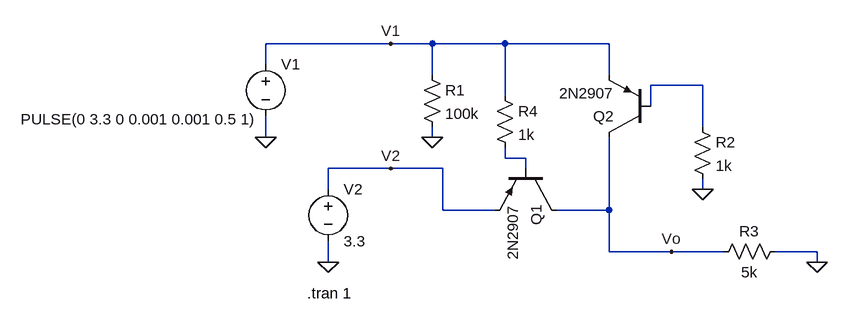
[diagram p0: schematic Power Selector 2.asc]
Power Selector 2.asc, the LTspice schematic file:
Version 4
SHEET 1 1080 680
WIRE 128 48 -64 48
WIRE 192 48 128 48
WIRE 304 48 192 48
WIRE 464 48 304 48
WIRE -64 80 -64 48
WIRE 192 96 192 48
WIRE 464 96 464 48
WIRE 608 112 528 112
WIRE 304 128 304 48
WIRE 528 144 528 112
WIRE 608 176 608 112
WIRE -64 192 -64 160
WIRE 192 192 192 176
WIRE 304 224 304 208
WIRE 336 224 304 224
WIRE 128 240 32 240
WIRE 208 240 128 240
WIRE 336 240 336 224
WIRE 32 272 32 240
WIRE 608 272 608 256
WIRE 208 304 208 240
WIRE 288 304 208 304
WIRE 464 304 464 192
WIRE 464 304 384 304
WIRE 464 368 464 304
WIRE 560 368 464 368
WIRE 640 368 560 368
WIRE 784 368 720 368
WIRE 32 384 32 352
WIRE 784 384 784 368
FLAG -64 192 0
FLAG 32 384 0
FLAG 192 192 0
FLAG 608 272 0
FLAG 560 368 Vo
FLAG 784 384 0
FLAG 128 48 V1
FLAG 128 240 V2
SYMBOL voltage -64 64 R0
WINDOW 3 -377 100 Left 2
WINDOW 123 0 0 Left 0
WINDOW 39 0 0 Left 0
SYMATTR Value PULSE(0 3.3 0 0.001 0.001 0.5 1)
SYMATTR InstName V1
SYMBOL voltage 32 256 R0
WINDOW 123 0 0 Left 0
WINDOW 39 0 0 Left 0
SYMATTR InstName V2
SYMATTR Value 3.3
SYMBOL res 176 80 R0
SYMATTR InstName R1
SYMATTR Value 100k
SYMBOL res 592 160 R0
SYMATTR InstName R2
SYMATTR Value 1k
SYMBOL res 736 352 R90
WINDOW 0 0 56 VBottom 2
WINDOW 3 32 56 VTop 2
SYMATTR InstName R3
SYMATTR Value 5k
SYMBOL res 288 112 R0
SYMATTR InstName R4
SYMATTR Value 1k
SYMBOL pnp 384 240 R90
SYMATTR InstName Q1
SYMATTR Value 2N2907
SYMBOL pnp 528 192 R180
SYMATTR InstName Q2
SYMATTR Value 2N2907
TEXT 0 432 Left 2 !.tran 1

The netlist it stands for:
* Power Selector 2.asc
V1 V1 0 PULSE(0 3.3 0 0.001 0.001 0.5 1)
V2 V2 0 3.3
R1 V1 0 100k
R2 N001 0 1k
R3 0 Vo 5k
R4 V1 N002 1k
Q1 Vo N002 V2 0 2N2907
Q2 Vo N001 V1 0 2N2907
.model NPN NPN
.model PNP PNP
.lib standard.bjt
.tran 1
.backanno
.end